# EAGLE design tc9163af-relays (EAGLE 7.0.0)
Relay replacement for TC9163AF This is a relay board to replace the notoriously shitty Toshiba TC9163AF chip acting as the input selector
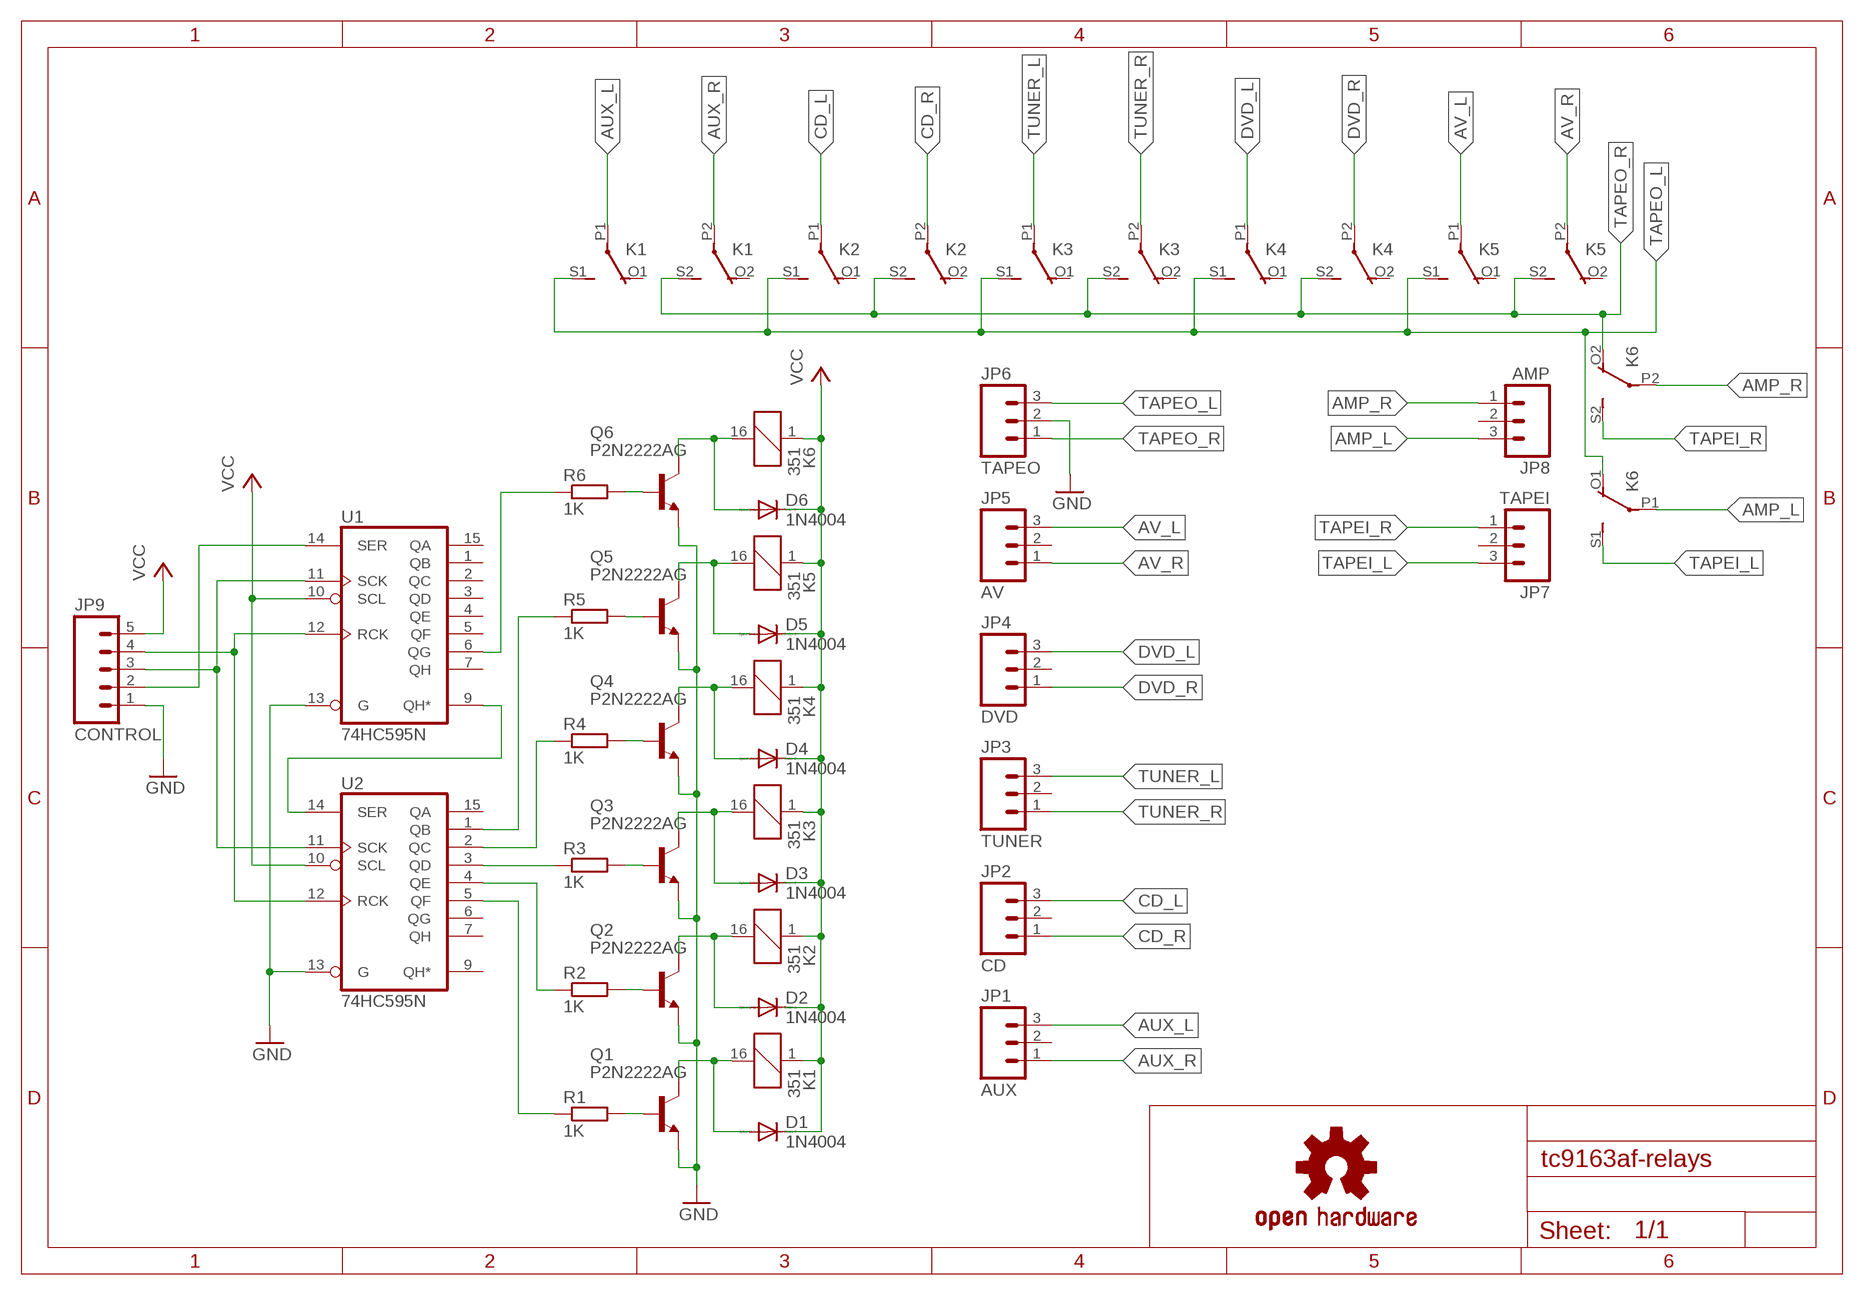
[diagram p0: schematic, sheet 1]

## Parts
D1  1N4004  [DO41-10]
D2  1N4004  [DO41-10]
D3  1N4004  [DO41-10]
D4  1N4004  [DO41-10]
D5  1N4004  [DO41-10]
D6  1N4004  [DO41-10]
JP1  AUX  M03PTH  [1X03]
JP2  CD  M03PTH  [1X03]
JP3  TUNER  M03PTH  [1X03]
JP4  DVD  M03PTH  [1X03]
JP5  AV  M03PTH  [1X03]
JP6  TAPEO  M03PTH  [1X03]
JP7  TAPEI  M03PTH  [1X03]
JP8  AMP  M03PTH  [1X03]
JP9  CONTROL  M05PTH  [1X05]
K1  351  [351]
K2  351  [351]
K3  351  [351]
K4  351  [351]
K5  351  [351]
K6  351  [351]
LOGO1  OSHW-LOGOL  [OSHW-LOGO-L]
Q1  P2N2222AG  2N2222-NPN-TO92-EBC  [TO92-EBC]
Q2  P2N2222AG  2N2222-NPN-TO92-EBC  [TO92-EBC]
Q3  P2N2222AG  2N2222-NPN-TO92-EBC  [TO92-EBC]
Q4  P2N2222AG  2N2222-NPN-TO92-EBC  [TO92-EBC]
Q5  P2N2222AG  2N2222-NPN-TO92-EBC  [TO92-EBC]
Q6  P2N2222AG  2N2222-NPN-TO92-EBC  [TO92-EBC]
R1  1K  R-EU_0207/10  [0207/10]
R2  1K  R-EU_0207/10  [0207/10]
R3  1K  R-EU_0207/10  [0207/10]
R4  1K  R-EU_0207/10  [0207/10]
R5  1K  R-EU_0207/10  [0207/10]
R6  1K  R-EU_0207/10  [0207/10]
U1  74HC595N  [DIL16]
U2  74HC595N  [DIL16]

## Nets
AMP_L: JP8.3 K6.P1(2:P)
AMP_R: JP8.1 K6.P2(3:P)
AUX_L: JP1.3 K1.P1(2:P)
AUX_R: JP1.1 K1.P2(3:P)
AV_L: JP5.3 K5.P1(2:P)
AV_R: JP5.1 K5.P2(3:P)
CD_L: JP2.3 K2.P1(2:P)
CD_R: JP2.1 K2.P2(3:P)
CLOCK: JP9.3 U1.11(SCK) U2.11(SCK)
DATA: JP9.2 U1.14(SER)
DVD_L: JP4.3 K4.P1(2:P)
DVD_R: JP4.1 K4.P2(3:P)
GND [power]: JP6.2 JP9.1 Q1.E Q2.E Q3.E Q4.E Q5.E Q6.E U1.13(G) U2.13(G)
N$1: U1.9(QH*) U2.14(SER)
N$2: R4.1 U2.2(QC)
N$3: R5.1 U2.1(QB)
N$4: R1.1 U2.5(QF)
N$5: R2.1 U2.4(QE)
N$6: R3.1 U2.3(QD)
N$7: R6.1 U1.6(QG)
N$8: Q1.B R1.2
N$9 [power]: D1.A K1.16 Q1.C
N$10: Q5.B R5.2
N$11: Q2.B R2.2
N$12 [power]: D2.A K2.16 Q2.C
N$13: Q6.B R6.2
N$14 [power]: D6.A K6.16 Q6.C
N$15: Q3.B R3.2
N$17 [power]: D3.A K3.16 Q3.C
N$20: Q4.B R4.2
N$22 [power]: D4.A K4.16 Q4.C
N$26 [power]: D5.A K5.16 Q5.C
STROBE: JP9.4 U1.12(RCK) U2.12(RCK)
TAPEI_L: JP7.3 K6.S1(2:S)
TAPEI_R: JP7.1 K6.S2(3:S)
TAPEO_L: JP6.3 K1.S1(2:S) K2.S1(2:S) K3.S1(2:S) K4.S1(2:S) K5.S1(2:S) K6.O1(2:O)
TAPEO_R: JP6.1 K1.S2(3:S) K2.S2(3:S) K3.S2(3:S) K4.S2(3:S) K5.S2(3:S) K6.O2(3:O)
TUNER_L: JP3.3 K3.P1(2:P)
TUNER_R: JP3.1 K3.P2(3:P)
VCC [power]: D1.C D2.C D3.C D4.C D5.C D6.C JP9.5 K1.1 K2.1 K3.1 K4.1 K5.1 K6.1 U1.10(SCL) U2.10(SCL)
Unconnected: JP1.2 JP2.2 JP3.2 JP4.2 JP5.2 JP7.2 JP8.2 K1.O1(2:O) K1.O2(3:O) K2.O1(2:O) K2.O2(3:O) K3.O1(2:O) K3.O2(3:O) K4.O1(2:O) K4.O2(3:O) K5.O1(2:O) K5.O2(3:O) U1.1(QB) U1.2(QC) U1.3(QD) U1.4(QE) U1.5(QF) U1.7(QH) U1.15(QA) U2.6(QG) U2.7(QH) U2.9(QH*) U2.15(QA)

## Power pins joined to a net without a drawn wire
GND: U1.8(GND) U2.8(GND)
VCC: U1.16(VCC) U2.16(VCC)

## Library data of the parts
D1-D6 = diode:1N4004: DIODE general purpose rectifier, 1 A
JP1-JP8 = SparkFun-Connectors:M03: Header 3 Standard 3-pin 0.1" header. Use with straight break away headers (SKU : PRT-00116), right angle break away headers (PRT-00553), swiss pins (PRT-00743), machine pins (PRT-00117), and female headers (PRT-00115). Molex polarized connector foot print use with SKU : PRT-08232 with associated crimp pins and housings.
JP9 = SparkFun-Connectors:M05: Header 5 Standard 5-pin 0.1" header. Use with straight break away headers (SKU : PRT-00116), right angle break away headers (PRT-00553), swiss pins (PRT-00743), machine pins (PRT-00117), and female headers (PRT-00115). Molex polarized connector foot print use with SKU : PRT-08230 with associated crimp pins and housings.
K1-K6 = relay:351: RELAY 2 x switch, Omron; OC_FARNELL: unknown; OC_NEWARK: unknown
LOGO1 = SparkFun-Aesthetics:OSHW-LOGO: Open Source Hardware Logo This logo indicates the piece of hardware it is found on incorporates a OSHW license and/or adheres to the definition of open source hardware found here: http://freedomdefined.org/OSHW
Q1-Q6 = transistor-neu-to92:*-NPN-: NPN Transistror
R1-R6 = rcl:R-EU_: RESISTOR, European symbol
U1 U2 = 74xx-eu:74*595: 8-bit SHIFT REGISTER, output latch

## Net classes
1 power: width 1.016 mm, clearance 0.508 mm

## Board
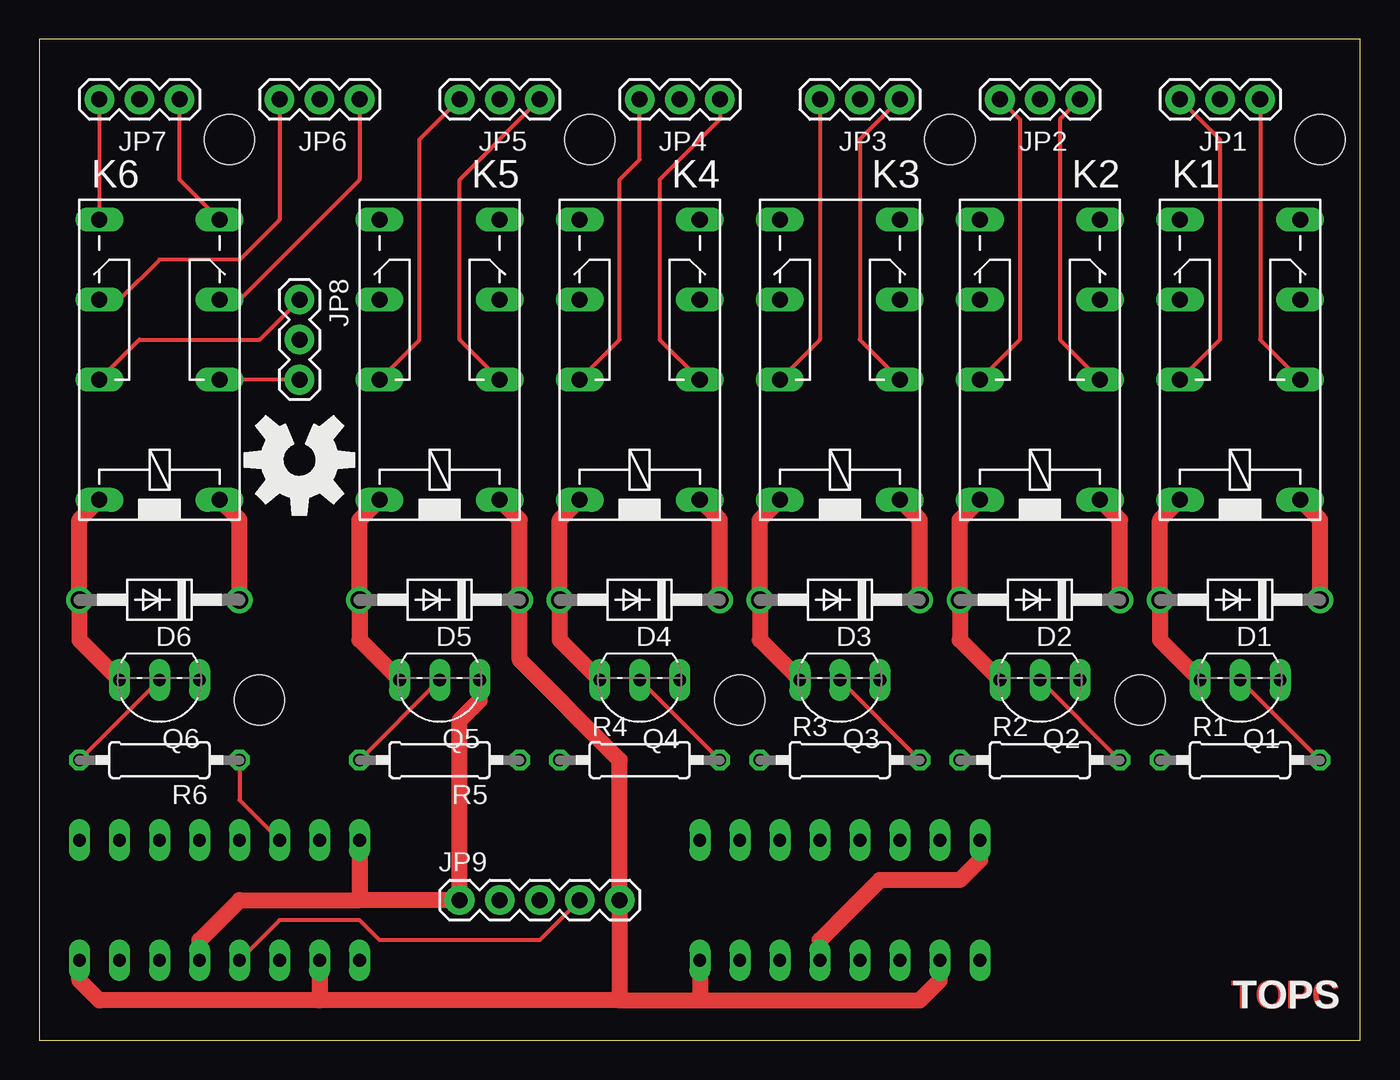
[diagram p1: board, top side]
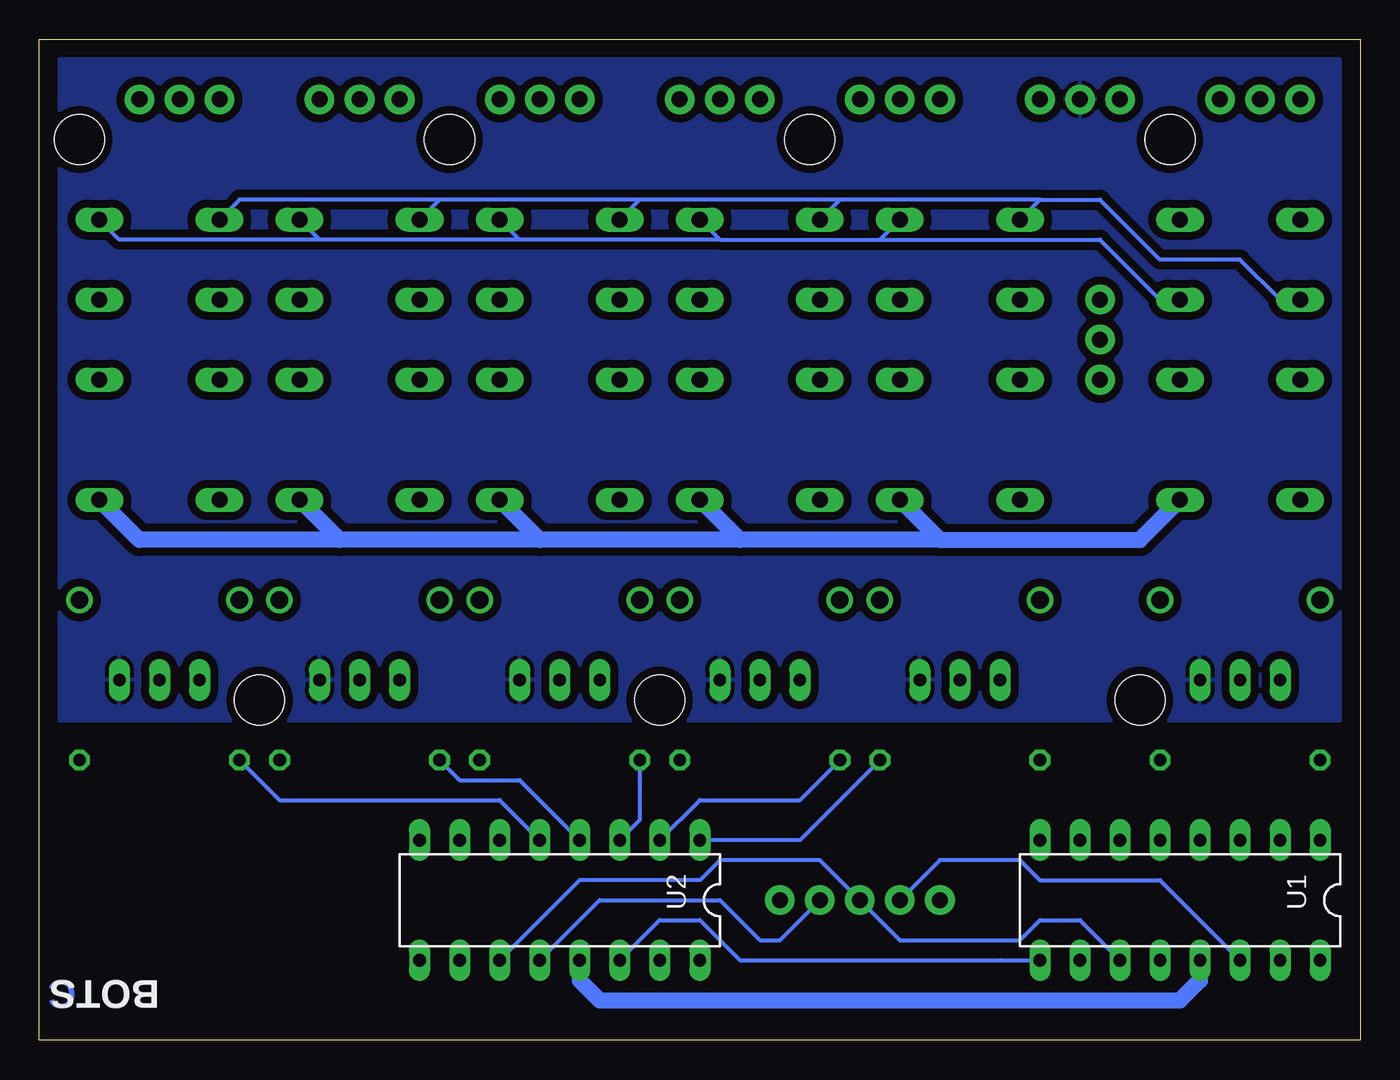
[diagram p2: board, bottom side, seen from below]

Size 83.82 x 63.5 mm. Coordinates in mm from the lower left corner, seen from the top.
Outline: 0,0 83.82,0 83.82,63.5 0,63.5 0,0
Copper layers (1*16): Top 0.035mm / dielectric 1.5mm / Bottom 0.035mm
Design rules "ITEADstudio_DRC": minimum track width 10mil, minimum drill 12mil, track to track 10mil, track to pad 10mil, pad to pad 10mil, via to via 10mil, smd to smd 0mil, copper to edge 20mil, drill to drill 10mil, minimum pad ring 10mil, minimum via ring 6mil, stop-mask expansion 4mil, vias tented up to drill 100mil, thermal gap 10mil
Holes 3.17 mm at 81.28,57.15 12.06,57.15 34.92,57.15 57.78,57.15 44.45,21.59 69.85,21.59 13.97,21.59

### Footprints (pad centres in the part's own frame; a part is rotated, then mirrored left to right if it is on the bottom)
DO41-10 = drill 1.118: A 5.08,0; C -5.08,0
1X03 = drill 1.016 pad 1.88: 1 0,0; 2 2.54,0; 3 5.08,0
1X05 = drill 1.016 pad 1.88: 1 0,0; 2 2.54,0; 3 5.08,0; 4 7.62,0; 5 10.16,0
351 = drill 1.016 long: 1 -3.81,-3.81; 16 -3.81,3.81; O1 8.89,-3.81; O2 8.89,3.81; P1 3.81,-3.81; P2 3.81,3.81; S1 13.97,-3.81; S2 13.97,3.81
TO92-EBC = drill 0.813 long: B 0,-1.27; C 2.54,-1.27; E -2.54,-1.27
0207/10 = drill 0.813 octagon: 1 -5.08,0; 2 5.08,0
DIL16 = drill 0.813 long: 1 -8.89,-3.81; 2 -6.35,-3.81; 3 -3.81,-3.81; 4 -1.27,-3.81; 5 1.27,-3.81; 6 3.81,-3.81; 7 6.35,-3.81; 8 8.89,-3.81; 9 8.89,3.81; 10 6.35,3.81; 11 3.81,3.81; 12 1.27,3.81; 13 -1.27,3.81; 14 -3.81,3.81; 15 -6.35,3.81; 16 -8.89,3.81

### Placement (x,y rotation side)
D1  76.2,27.94 180 top
D2  63.5,27.94 180 top
D3  50.8,27.94 180 top
D4  38.1,27.94 180 top
D5  25.4,27.94 180 top
D6  7.62,27.94 180 top
JP1  72.39,59.69 0 top
JP2  60.96,59.69 0 top
JP3  49.53,59.69 0 top
JP4  38.1,59.69 0 top
JP5  26.67,59.69 0 top
JP6  15.24,59.69 0 top
JP7  3.81,59.69 0 top
JP8  16.51,46.99 270 top
JP9  26.67,8.89 0 top
K1  76.2,38.1 90 top
K2  63.5,38.1 90 top
K3  50.8,38.1 90 top
K4  38.1,38.1 90 top
K5  25.4,38.1 90 top
K6  7.62,38.1 90 top
LOGO1  16.51,36.83 180 top
Q1  76.2,21.59 180 top
Q2  63.5,21.59 180 top
Q3  50.8,21.59 180 top
Q4  38.1,21.59 180 top
Q5  25.4,21.59 180 top
Q6  7.62,21.59 180 top
R1  76.2,17.78 0 top
R2  63.5,17.78 0 top
R3  50.8,17.78 0 top
R4  38.1,17.78 0 top
R5  25.4,17.78 180 top
R6  7.62,17.78 180 top
U1  11.43,8.89 180 bottom
U2  50.8,8.89 180 bottom

### Tracks (layer width: path | path; a pad name or v marks a point on that pad's centre or on a via)
AMP_L
  Top 0.254: JP8.3 K6.P1
AMP_R
  Top 0.254: K6.P2 6.35,44.45 13.97,44.45 JP8.1
AUX_L
  Top 0.254: K1.P1 77.47,44.45 JP1.3
AUX_R
  Top 0.254: K1.P2 74.93,44.45 74.93,57.15 JP1.1
AV_L
  Top 0.254: K5.P1 26.67,44.45 26.67,54.61 JP5.3
AV_R
  Top 0.254: K5.P2 24.13,44.45 24.13,57.15 JP5.1
CD_L
  Top 0.254: K2.P1 64.77,44.45 64.77,58.42 JP2.3
CD_R
  Top 0.254: K2.P2 62.23,44.45 62.23,58.42 JP2.1
CLOCK
  Bottom 0.254: U1.11 17.78,7.62 20.32,7.62 21.59,6.35 29.21,6.35 JP9.3 34.29,11.43 40.64,11.43 41.91,10.16 49.53,10.16 U2.11
DATA
  Bottom 0.254: U1.14 12.7,10.16 20.32,10.16 21.59,11.43 26.67,11.43 JP9.2
DVD_L
  Top 0.254: K4.P1 39.37,44.45 39.37,54.61 43.18,58.42 JP4.3
DVD_R
  Top 0.254: K4.P2 36.83,44.45 36.83,54.61 38.1,55.88 JP4.1
GND
  Top 1.016: U1.13 10.16,6.35 12.7,8.89 20.32,8.89 | 20.32,8.89 25.4,8.89 JP9.1 26.67,20.32 27.94,21.59 Q5.E | U1.8 20.32,8.89 | U2.8 59.69,11.43 58.42,10.16 53.34,10.16 49.53,6.35 U2.13
  Bottom 1.016: U2.13 49.53,3.81 48.26,2.54 11.43,2.54 10.16,3.81 U1.13
  pour Bottom (isolate 0.254): 1.27,62.23 82.55,62.23 82.55,20.32 1.27,20.32
N$1
  Bottom 0.254: U1.9 22.86,5.08 39.37,5.08 41.91,7.62 44.45,7.62 U2.14
N$2
  Bottom 0.254: R4.1 35.56,15.24 41.91,15.24 U2.2
N$3
  Bottom 0.254: R5.1 35.56,12.7 U2.1
N$4
  Bottom 0.254: U2.5 54.61,15.24 68.58,15.24 R1.1
N$5
  Bottom 0.254: U2.4 53.34,16.51 57.15,16.51 R2.1
N$6
  Bottom 0.254: U2.3 45.72,13.97 R3.1
N$7
  Top 0.254: U1.6 12.7,15.24 R6.1
N$8
  Top 0.254: Q1.B R1.2
N$9
  Top 1.016: Q1.C 71.12,25.4 D1.A 71.12,33.02 K1.16
N$10
  Top 0.254: R5.2 Q5.B
N$11
  Top 0.254: Q2.B R2.2
N$12
  Top 1.016: Q2.C 58.42,25.4 D2.A 58.42,33.02 K2.16
N$13
  Top 0.254: Q6.B R6.2
N$14
  Top 1.016: Q6.C 2.54,25.4 D6.A 2.54,33.02 K6.16
N$15
  Top 0.254: Q3.B R3.2
N$17
  Top 1.016: Q3.C 45.72,25.4 D3.A 45.72,33.02 K3.16
N$20
  Top 0.254: Q4.B R4.2
N$22
  Top 1.016: Q4.C 33.02,25.4 D4.A 33.02,33.02 K4.16
N$26
  Top 1.016: Q5.C 20.32,25.4 D5.A 20.32,33.02 K5.16
STROBE
  Top 0.254: JP9.4 31.75,6.35 21.59,6.35 20.32,7.62 15.24,7.62 U1.12
  Bottom 0.254: JP9.4 36.83,6.35 38.1,6.35 40.64,8.89 48.26,8.89 U2.12
TAPEI_L
  Top 0.254: K6.S1 8.89,54.61 JP7.3
TAPEI_R
  Top 0.254: JP7.1 K6.S2
TAPEO_L
  Top 0.254: JP6.3 20.32,54.61 12.7,46.99 K6.O1
  Bottom 0.254: 30.48,50.8 K5.S1 | 40.64,50.8 30.48,50.8 | K4.S1 40.64,50.8 | 53.34,50.8 K3.S1 | 40.64,50.8 53.34,50.8 | 66.04,50.8 K2.S1 | 53.34,50.8 66.04,50.8 | K1.S1 78.74,50.8 66.04,50.8 | 30.48,50.8 16.51,50.8 12.7,46.99 K6.O1
TAPEO_R
  Top 0.254: JP6.1 15.24,52.07 12.7,49.53 7.62,49.53 5.08,46.99 K6.O2
  Bottom 0.254: 20.32,53.34 K5.S2 | 33.02,53.34 K4.S2 | 20.32,53.34 33.02,53.34 | 45.72,53.34 K3.S2 | 33.02,53.34 45.72,53.34 | 58.42,53.34 K2.S2 | 45.72,53.34 58.42,53.34 | K1.S2 71.12,53.34 58.42,53.34 | K6.O2 5.08,46.99 7.62,49.53 12.7,49.53 16.51,53.34 20.32,53.34
TUNER_L
  Top 0.254: K3.P1 52.07,44.45 52.07,57.15 JP3.3
TUNER_R
  Top 0.254: K3.P2 49.53,44.45 JP3.1
VCC
  Top 1.016: K1.1 81.28,33.02 D1.C | K2.1 68.58,33.02 D2.C | K3.1 55.88,33.02 D3.C | K4.1 43.18,33.02 D4.C | K6.1 12.7,33.02 D6.C | K5.1 30.48,33.02 D5.C 30.48,24.13 36.83,17.78 JP9.5 36.83,2.54 | 36.83,2.54 41.91,2.54 | U2.16 41.91,2.54 | 41.91,2.54 55.88,2.54 57.15,3.81 U2.10 | 36.83,2.54 17.78,2.54 | U1.10 17.78,2.54 | 17.78,2.54 3.81,2.54 2.54,3.81 U1.16
  Bottom 1.016: 26.67,31.75 13.97,31.75 K6.1 | K5.1 26.67,31.75 | 39.37,31.75 K4.1 | 26.67,31.75 39.37,31.75 | 52.07,31.75 K3.1 | 39.37,31.75 52.07,31.75 | 64.77,31.75 K2.1 | 52.07,31.75 64.77,31.75 | K1.1 77.47,31.75 64.77,31.75

### Text on the board
Top: TOPC
Bottom: BOTC
tPlace: TOPS
bPlace: BOTS